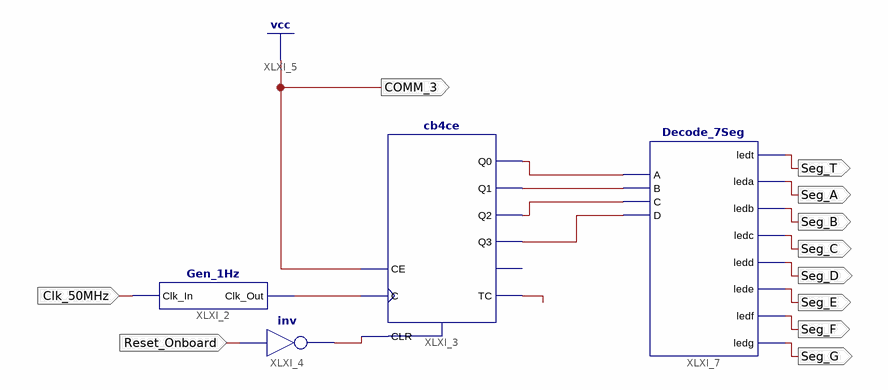
[diagram p0: schematic sheet 1]
// Xilinx ISE schematic abc.sch (spartan6) as structural Verilog: 4 symbols, 11 ports
module abc (
  input  Clk_50MHz,
  input  Reset_Onboard,
  output COMM_3,
  output Seg_T,
  output Seg_A,
  output Seg_B,
  output Seg_C,
  output Seg_D,
  output Seg_E,
  output Seg_F,
  output Seg_G
);

  wire XLXN_7, XLXN_17, XLXN_24, XLXN_28, XLXN_29, XLXN_30, XLXN_31;

  Gen_1Hz XLXI_2 (.Clk_In(Clk_50MHz), .Clk_Out(XLXN_7));
  cb4ce XLXI_3 (
    .C(XLXN_7), .CE(1'b1), .CLR(XLXN_17), .Q0(XLXN_28), .Q1(XLXN_29), .Q2(XLXN_30), .Q3(XLXN_31), .TC(XLXN_24));  // open: CEO
  not XLXI_4 (XLXN_17, Reset_Onboard);
  Decode_7Seg XLXI_7 (
    .ledt(Seg_T), .leda(Seg_A), .ledb(Seg_B), .ledc(Seg_C), .ledd(Seg_D), .lede(Seg_E), .ledf(Seg_F),
    .ledg(Seg_G), .A(XLXN_28), .B(XLXN_29), .C(XLXN_30), .D(XLXN_31));

  assign COMM_3 = 1'b1;
endmodule
